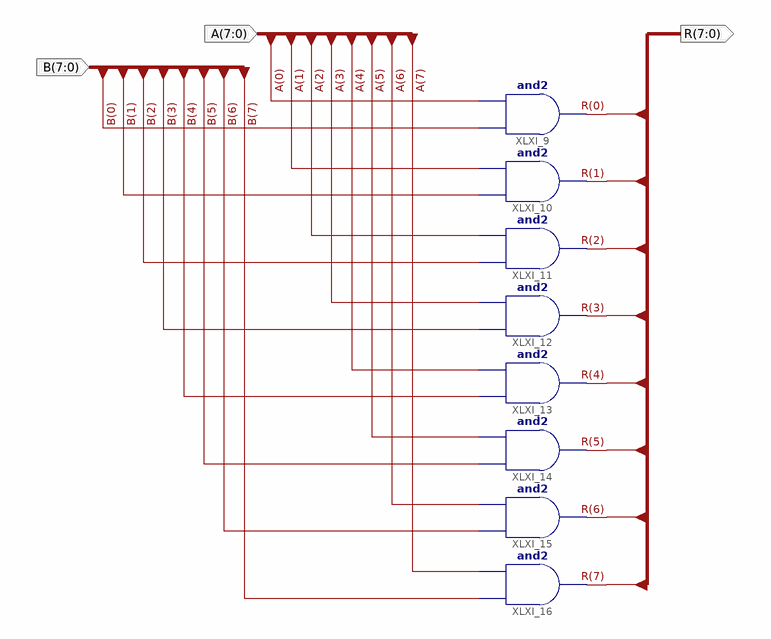
[diagram p0: schematic sheet 1]
// Xilinx ISE schematic and2x8b.sch (spartan6) as structural Verilog: 8 symbols, 3 ports
module and2x8b (
  input  [7:0] B,
  input  [7:0] A,
  output [7:0] R
);

  and XLXI_9 (R[0], B[0], A[0]);
  and XLXI_10 (R[1], B[1], A[1]);
  and XLXI_11 (R[2], B[2], A[2]);
  and XLXI_12 (R[3], B[3], A[3]);
  and XLXI_13 (R[4], B[4], A[4]);
  and XLXI_14 (R[5], B[5], A[5]);
  and XLXI_15 (R[6], B[6], A[6]);
  and XLXI_16 (R[7], B[7], A[7]);
endmodule
